# EAGLE design Solenoid Driver x8 (EAGLE 9.6.2)
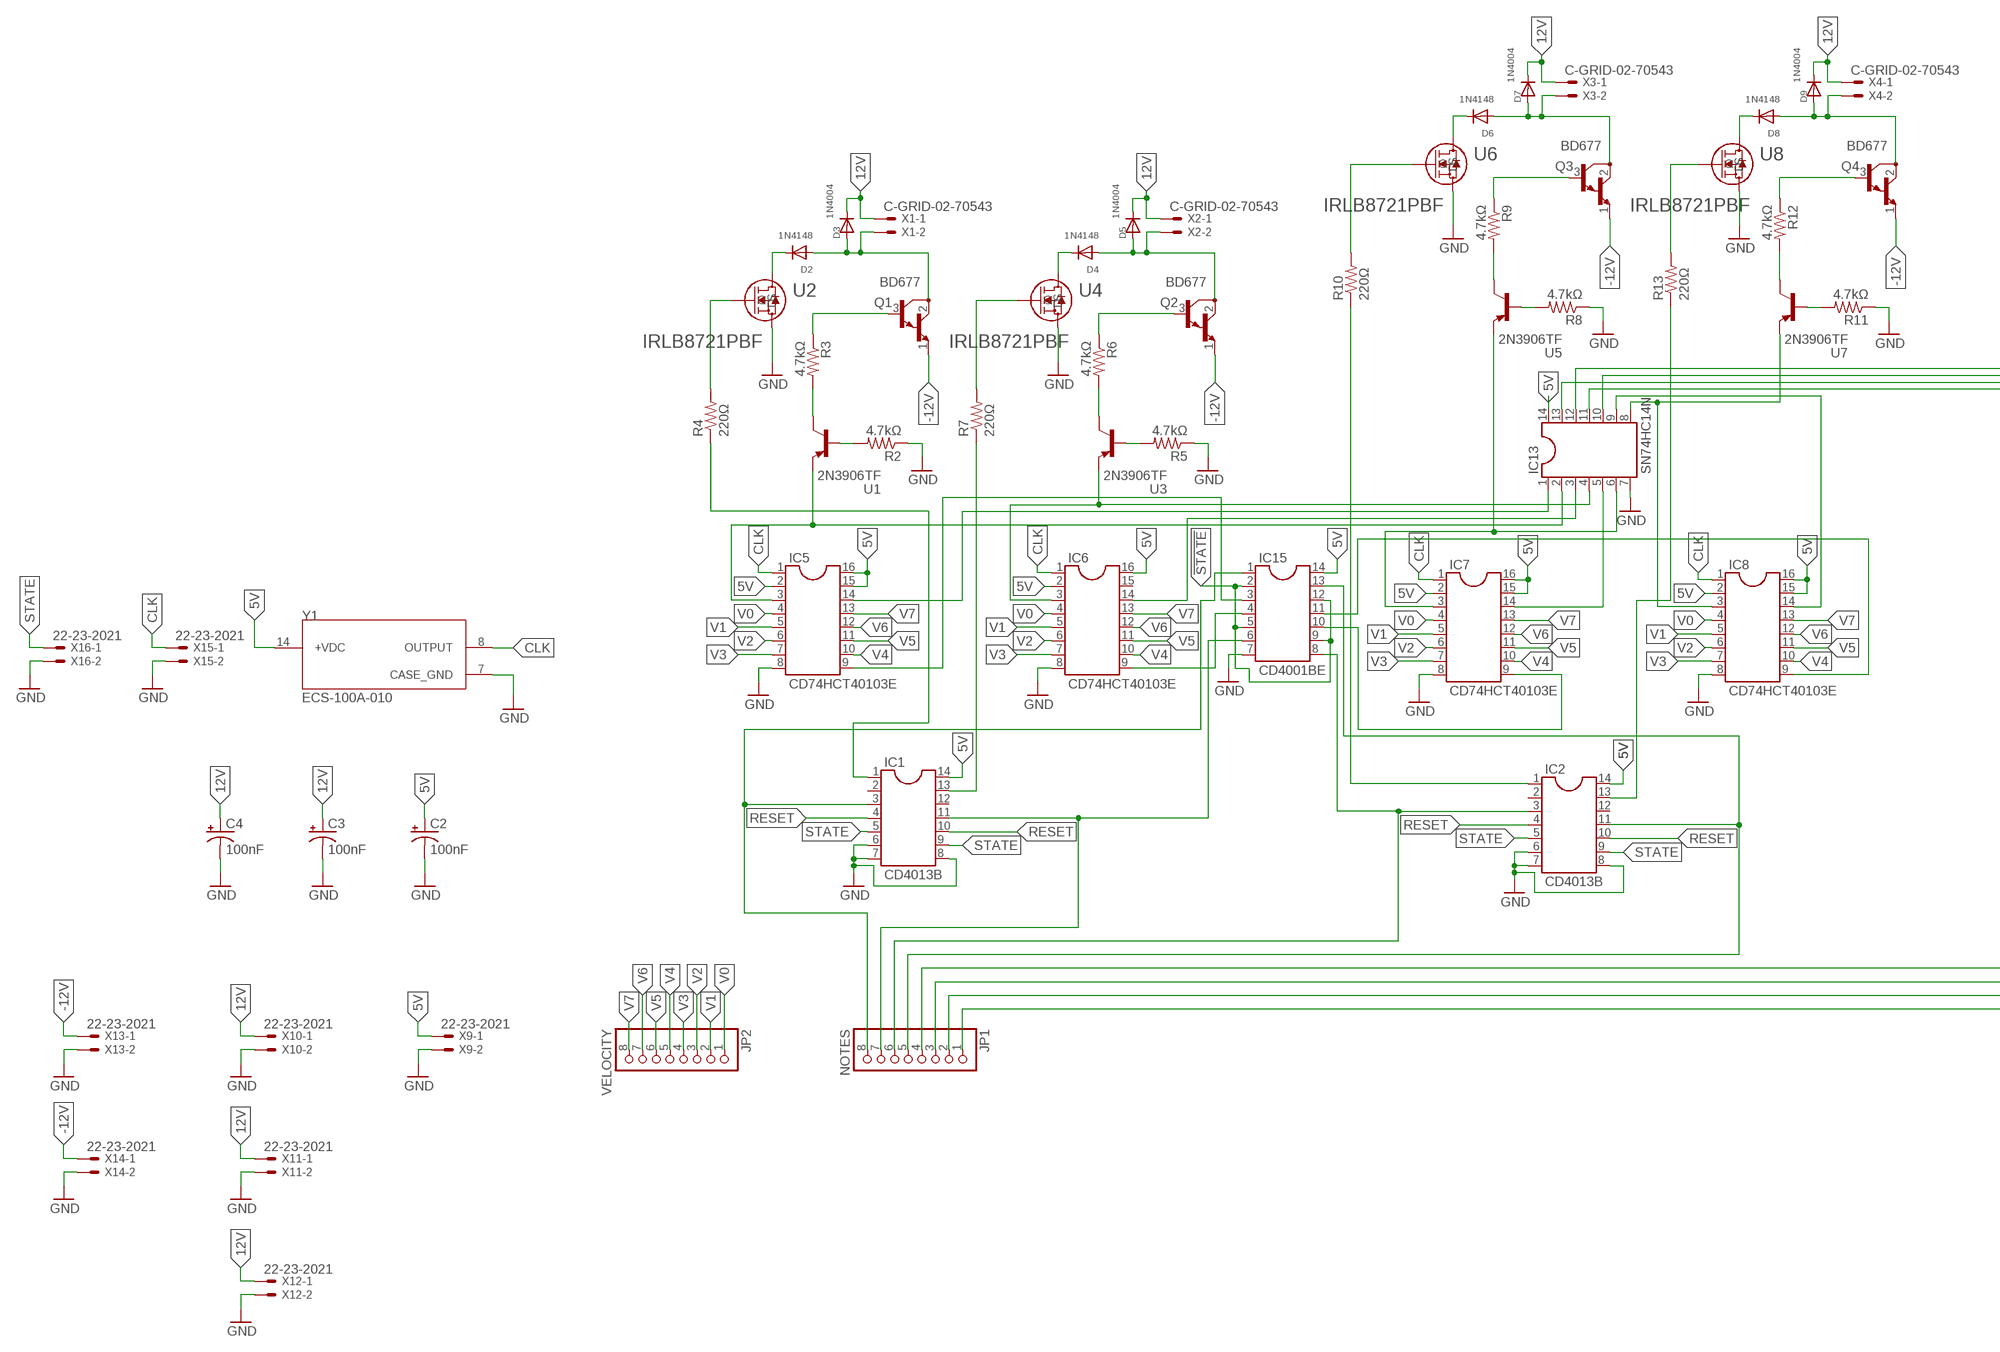
[diagram p0: schematic, sheet 1, part 1 of 2]
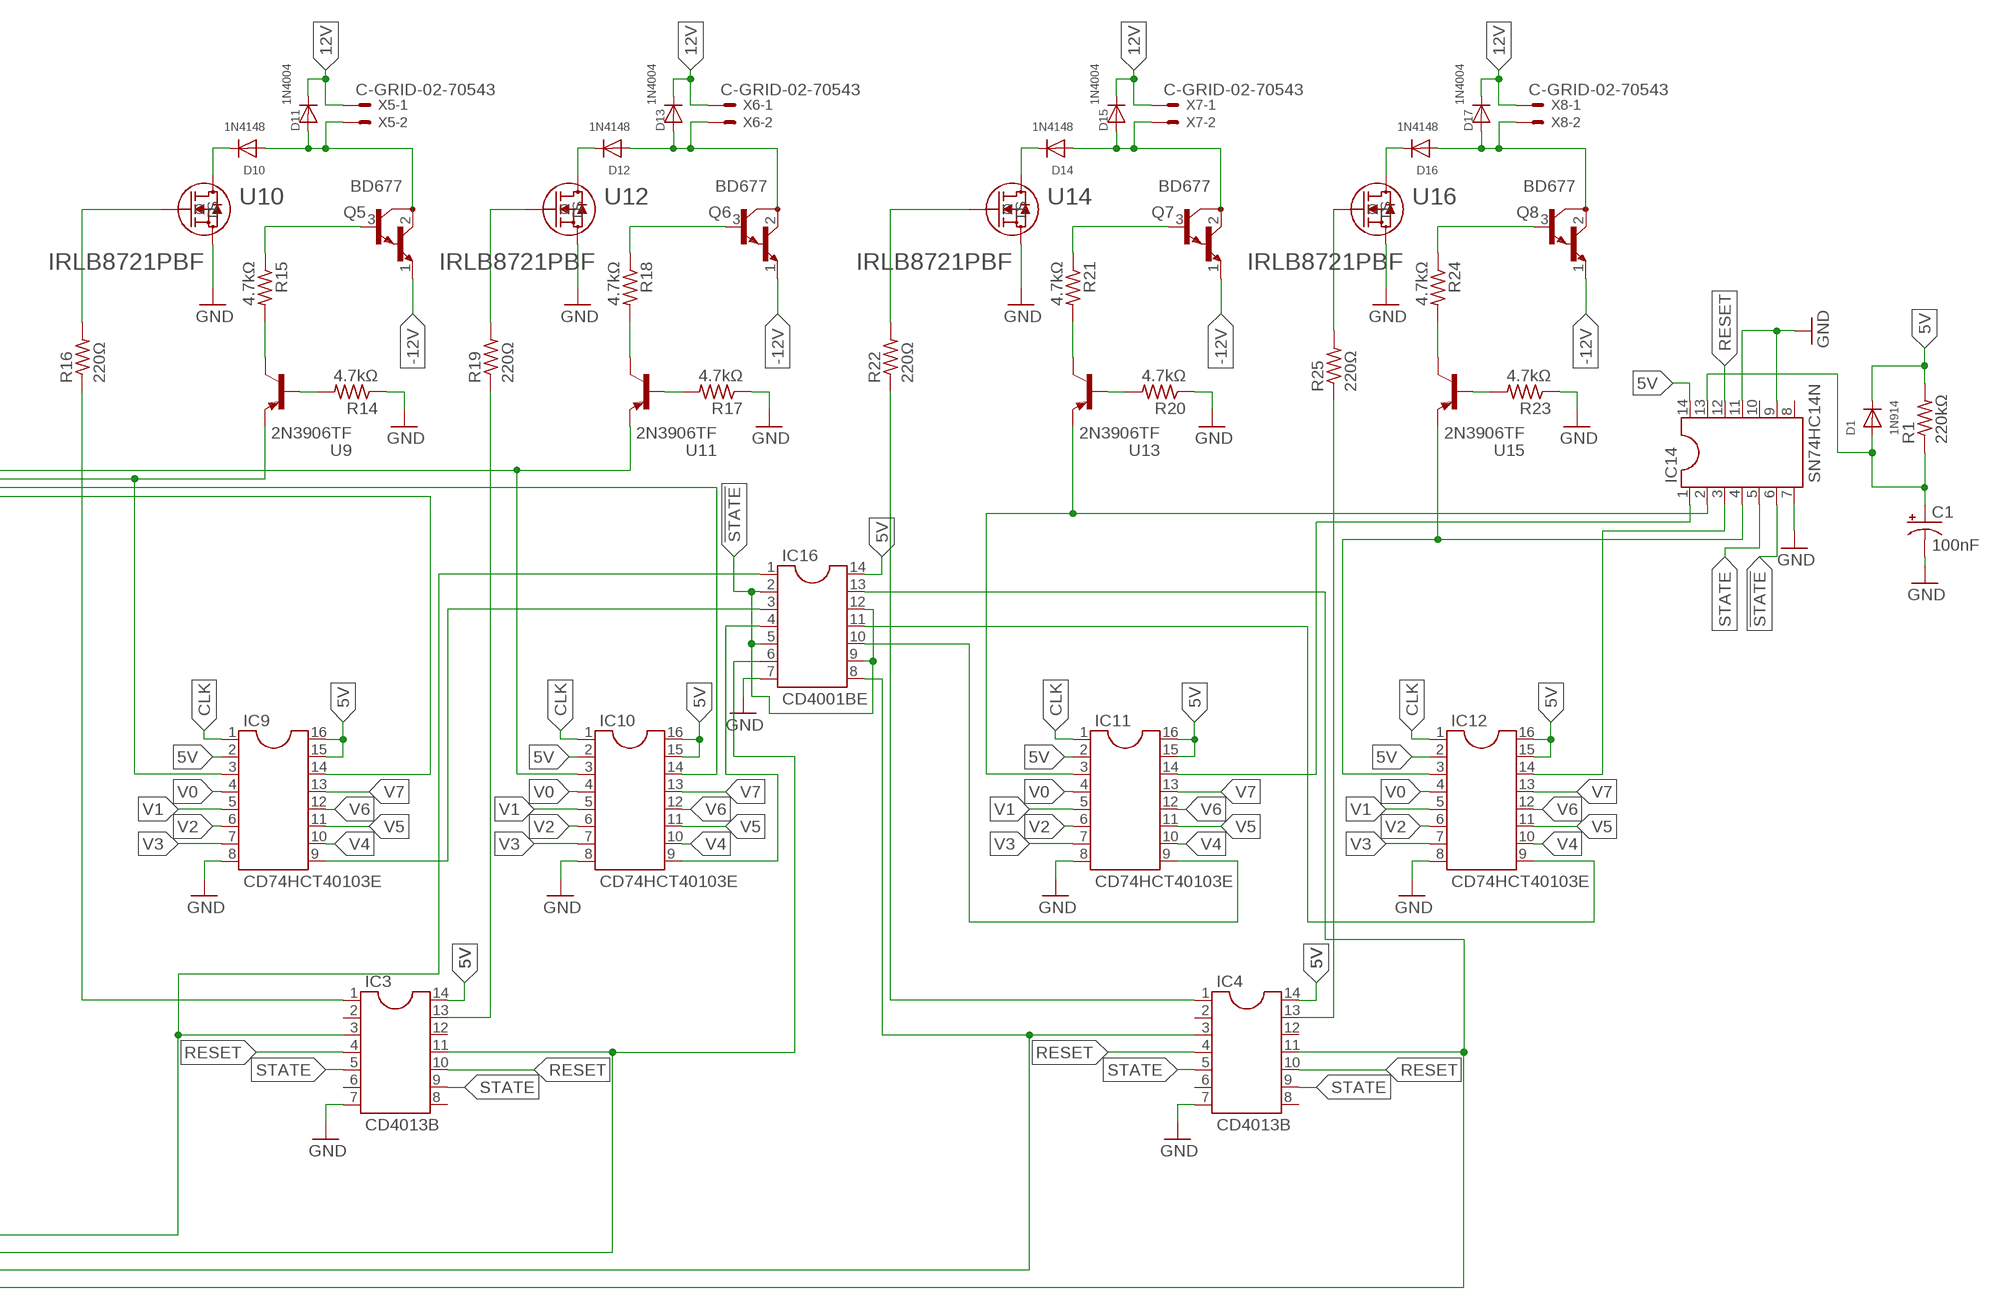
[diagram p1: schematic, sheet 1, part 2 of 2]

## Parts
C1  100nF  CPOL-USE1.8-4  [E1,8-4]
C2  100nF  CPOL-USE1.8-4  [E1,8-4]
C3  100nF  CPOL-USE1.8-4  [E1,8-4]
C4  100nF  CPOL-USE1.8-4  [E1,8-4]
D1  1N914  DIODEDO-1N4148  [DO-1N4148]
D2  1N4148  DIODEDO-1N4148  [DO-1N4148]
D3  1N4004  DIODEDO-1N4148  [DO-1N4148]
D4  1N4148  DIODEDO-1N4148  [DO-1N4148]
D5  1N4004  DIODEDO-1N4148  [DO-1N4148]
D6  1N4148  DIODEDO-1N4148  [DO-1N4148]
D7  1N4004  DIODEDO-1N4148  [DO-1N4148]
D8  1N4148  DIODEDO-1N4148  [DO-1N4148]
D9  1N4004  DIODEDO-1N4148  [DO-1N4148]
D10  1N4148  DIODEDO-1N4148  [DO-1N4148]
D11  1N4004  DIODEDO-1N4148  [DO-1N4148]
D12  1N4148  DIODEDO-1N4148  [DO-1N4148]
D13  1N4004  DIODEDO-1N4148  [DO-1N4148]
D14  1N4148  DIODEDO-1N4148  [DO-1N4148]
D15  1N4004  DIODEDO-1N4148  [DO-1N4148]
D16  1N4148  DIODEDO-1N4148  [DO-1N4148]
D17  1N4004  DIODEDO-1N4148  [DO-1N4148]
IC1  CD4013B  DIL14S  [SOCKET-14]
IC2  CD4013B  DIL14S  [SOCKET-14]
IC3  CD4013B  DIL14S  [SOCKET-14]
IC4  CD4013B  DIL14S  [SOCKET-14]
IC5  CD74HCT40103E  DIL16S  [SOCKET-16]
IC6  CD74HCT40103E  DIL16S  [SOCKET-16]
IC7  CD74HCT40103E  DIL16S  [SOCKET-16]
IC8  CD74HCT40103E  DIL16S  [SOCKET-16]
IC9  CD74HCT40103E  DIL16S  [SOCKET-16]
IC10  CD74HCT40103E  DIL16S  [SOCKET-16]
IC11  CD74HCT40103E  DIL16S  [SOCKET-16]
IC12  CD74HCT40103E  DIL16S  [SOCKET-16]
IC13  SN74HC14N  DIL14S  [SOCKET-14]
IC14  SN74HC14N  DIL14S  [SOCKET-14]
IC15  CD4001BE  DIL14S  [SOCKET-14]
IC16  CD4001BE  DIL14S  [SOCKET-14]
JP1  NOTES  PINHD-1X8BIG  [1X08-BIG]
JP2  VELOCITY  PINHD-1X8BIG  [1X08-BIG]
Q1  BD677  [TO126]
Q2  BD677  [TO126]
Q3  BD677  [TO126]
Q4  BD677  [TO126]
Q5  BD677  [TO126]
Q6  BD677  [TO126]
Q7  BD677  [TO126]
Q8  BD677  [TO126]
R1  220kΩ  R-US_0207/10  [0207/10]
R2  4.7kΩ  R-US_0207/10  [0207/10]
R3  4.7kΩ  R-US_0207/10  [0207/10]
R4  220Ω  R-US_0207/10  [0207/10]
R5  4.7kΩ  R-US_0207/10  [0207/10]
R6  4.7kΩ  R-US_0207/10  [0207/10]
R7  220Ω  R-US_0207/10  [0207/10]
R8  4.7kΩ  R-US_0207/10  [0207/10]
R9  4.7kΩ  R-US_0207/10  [0207/10]
R10  220Ω  R-US_0207/10  [0207/10]
R11  4.7kΩ  R-US_0207/10  [0207/10]
R12  4.7kΩ  R-US_0207/10  [0207/10]
R13  220Ω  R-US_0207/10  [0207/10]
R14  4.7kΩ  R-US_0207/10  [0207/10]
R15  4.7kΩ  R-US_0207/10  [0207/10]
R16  220Ω  R-US_0207/10  [0207/10]
R17  4.7kΩ  R-US_0207/10  [0207/10]
R18  4.7kΩ  R-US_0207/10  [0207/10]
R19  220Ω  R-US_0207/10  [0207/10]
R20  4.7kΩ  R-US_0207/10  [0207/10]
R21  4.7kΩ  R-US_0207/10  [0207/10]
R22  220Ω  R-US_0207/10  [0207/10]
R23  4.7kΩ  R-US_0207/10  [0207/10]
R24  4.7kΩ  R-US_0207/10  [0207/10]
R25  220Ω  R-US_0207/10  [0207/10]
U1  2N3906TF  [TO-92-3L_5P33X5P2_ONS]
U2  IRLB8721PBF  [PG-TO220-3_INF]
U3  2N3906TF  [TO-92-3L_5P33X5P2_ONS]
U4  IRLB8721PBF  [PG-TO220-3_INF]
U5  2N3906TF  [TO-92-3L_5P33X5P2_ONS]
U6  IRLB8721PBF  [PG-TO220-3_INF]
U7  2N3906TF  [TO-92-3L_5P33X5P2_ONS]
U8  IRLB8721PBF  [PG-TO220-3_INF]
U9  2N3906TF  [TO-92-3L_5P33X5P2_ONS]
U10  IRLB8721PBF  [PG-TO220-3_INF]
U11  2N3906TF  [TO-92-3L_5P33X5P2_ONS]
U12  IRLB8721PBF  [PG-TO220-3_INF]
U13  2N3906TF  [TO-92-3L_5P33X5P2_ONS]
U14  IRLB8721PBF  [PG-TO220-3_INF]
U15  2N3906TF  [TO-92-3L_5P33X5P2_ONS]
U16  IRLB8721PBF  [PG-TO220-3_INF]
X1  C-GRID-02-70543  [70543-02]
X2  C-GRID-02-70543  [70543-02]
X3  C-GRID-02-70543  [70543-02]
X4  C-GRID-02-70543  [70543-02]
X5  C-GRID-02-70543  [70543-02]
X6  C-GRID-02-70543  [70543-02]
X7  C-GRID-02-70543  [70543-02]
X8  C-GRID-02-70543  [70543-02]
X9  22-23-2021  [22-23-2021]
X10  22-23-2021  [22-23-2021]
X11  22-23-2021  [22-23-2021]
X12  22-23-2021  [22-23-2021]
X13  22-23-2021  [22-23-2021]
X14  22-23-2021  [22-23-2021]
X15  22-23-2021  [22-23-2021]
X16  22-23-2021  [22-23-2021]
Y1  ECS-100A-010  [OSC_ECS-100A-010]

## Nets
5V: C2.+ D1.C IC1.14 IC2.14 IC3.14 IC4.14 IC5.2 IC5.15 IC5.16 IC6.2 IC6.16 IC7.2 IC7.15 IC7.16 IC8.2 IC8.15 IC8.16 IC9.2 IC9.15 IC9.16 IC10.2 IC10.15 IC10.16 IC11.2 IC11.15 IC11.16 IC12.2 IC12.15 IC12.16 IC13.14 IC14.14 IC15.14 IC16.14 R1.2 X9.1 Y1.14(+VDC)
12V: C3.+ C4.+ D3.C D5.C D7.C D9.C D11.C D13.C D15.C D17.C X1.1 X2.1 X3.1 X4.1 X5.1 X6.1 X7.1 X8.1 X10.1 X11.1 X12.1
!STATE: IC14.6 IC15.2 IC15.5 IC15.9 IC15.12 IC16.2 IC16.5 IC16.9 IC16.12
-12V: Q1.1(E) Q2.1(E) Q3.1(E) Q4.1(E) Q5.1(E) Q6.1(E) Q7.1(E) Q8.1(E) X13.1 X14.1
CLK: IC5.1 IC6.1 IC7.1 IC8.1 IC9.1 IC10.1 IC11.1 IC12.1 X15.1 Y1.8(OUTPUT)
GND: C1.- C2.- C3.- C4.- IC1.6 IC1.7 IC1.8 IC2.6 IC2.7 IC2.8 IC3.7 IC4.7 IC5.8 IC6.8 IC7.8 IC8.8 IC9.8 IC10.8 IC11.8 IC12.8 IC13.7 IC14.7 IC14.9 IC14.11 IC15.7 IC16.7 R2.1 R5.1 R8.1 R11.1 R14.1 R17.1 R20.1 R23.1 U2.3(S) U4.3(S) U6.3(S) U8.3(S) U10.3(S) U12.3(S) U14.3(S) U16.3(S) X9.2 X10.2 X11.2 X12.2 X13.2 X14.2 X15.2 X16.2 Y1.7(CASE_GND)
N$1: IC1.3 IC15.1 JP1.8
N$2: IC5.14 IC13.1
N$3: IC2.3 IC15.8 JP1.6
N$4: IC2.11 IC15.13 JP1.5
N$5: IC9.9 IC16.3
N$6: IC3.11 IC16.6 JP1.3
N$7: IC4.3 IC16.8 JP1.2
N$8: IC4.11 IC16.13 JP1.1
N$9: IC5.9 IC15.3
N$10: IC1.1 R4.1
N$11: IC5.3 IC13.2 U1.1(E)
N$12: Q1.3(B) R3.1
N$13: R3.2 U1.3(C)
N$14: R2.2 U1.2(B)
N$15: IC6.3 IC13.4 U3.1(E)
N$16: D2.A D3.A Q1.2(C) X1.2
N$17: D2.C U2.2(D)
N$18: IC1.11 IC15.6 JP1.7
N$19: C1.+ D1.A IC14.13 R1.1
N$20: R4.2 U2.1(G)
N$21: IC6.9 IC15.4
N$22: IC11.9 IC16.10
N$23: IC6.14 IC13.3
N$24: IC2.13 R13.1
N$25: Q2.3(B) R6.1
N$26: IC12.9 IC16.11
N$27: IC8.14 IC13.9
N$28: IC7.14 IC13.5
N$29: R6.2 U3.3(C)
N$30: IC3.3 IC16.1 JP1.4
N$31: IC3.1 R16.1
N$32: R5.2 U3.2(B)
N$34: D4.A D5.A Q2.2(C) X2.2
N$35: R7.2 U4.1(G)
N$36: D4.C U4.2(D)
N$38: IC4.1 R22.1
N$39: IC1.13 R7.1
N$41: IC12.14 IC14.3
N$42: IC11.14 IC14.1
N$43: Q5.3(B) R15.1
N$44: IC9.14 IC13.11
N$45: IC10.14 IC13.13
N$46: Q3.3(B) R9.1
N$47: R9.2 U5.3(C)
N$48: R8.2 U5.2(B)
N$49: D6.A D7.A Q3.2(C) X3.2
N$50: R10.2 U6.1(G)
N$51: D6.C U6.2(D)
N$52: IC7.3 IC13.6 U5.1(E)
N$53: Q4.3(B) R12.1
N$54: R12.2 U7.3(C)
N$55: R11.2 U7.2(B)
N$56: D8.A D9.A Q4.2(C) X4.2
N$57: R13.2 U8.1(G)
N$58: D8.C U8.2(D)
N$59: IC8.3 IC13.8 U7.1(E)
N$60: R15.2 U9.3(C)
N$61: IC2.1 R10.1
N$62: R14.2 U9.2(B)
N$63: D10.A D11.A Q5.2(C) X5.2
N$64: R16.2 U10.1(G)
N$65: D10.C U10.2(D)
N$67: Q6.3(B) R18.1
N$68: R18.2 U11.3(C)
N$69: R17.2 U11.2(B)
N$70: D12.A D13.A Q6.2(C) X6.2
N$71: R19.2 U12.1(G)
N$72: D12.C U12.2(D)
N$73: IC10.3 IC13.12 U11.1(E)
N$74: IC7.9 IC15.10
N$75: IC3.13 R19.1
N$76: Q7.3(B) R21.1
N$77: R21.2 U13.3(C)
N$78: R20.2 U13.2(B)
N$79: D14.A D15.A Q7.2(C) X7.2
N$80: R22.2 U14.1(G)
N$81: D14.C U14.2(D)
N$82: IC11.3 IC14.2 U13.1(E)
N$83: Q8.3(B) R24.1
N$84: R24.2 U15.3(C)
N$85: R23.2 U15.2(B)
N$86: D16.A D17.A Q8.2(C) X8.2
N$87: R25.2 U16.1(G)
N$88: D16.C U16.2(D)
N$89: IC12.3 IC14.4 U15.1(E)
N$90: IC4.13 R25.1
N$91: IC8.9 IC15.11
N$92: IC10.9 IC16.4
N$93: IC9.3 IC13.10 U9.1(E)
RESET: IC1.4 IC1.10 IC2.4 IC2.10 IC3.4 IC3.10 IC4.4 IC4.10 IC14.12
STATE: IC1.5 IC1.9 IC2.5 IC2.9 IC3.5 IC3.9 IC4.5 IC4.9 IC14.5 X16.1
V0: IC5.4 IC6.4 IC7.4 IC8.4 IC9.4 IC10.4 IC11.4 IC12.4 JP2.1
V1: IC5.5 IC6.5 IC7.5 IC8.5 IC9.5 IC10.5 IC11.5 IC12.5 JP2.2
V2: IC5.6 IC6.6 IC7.6 IC8.6 IC9.6 IC10.6 IC11.6 IC12.6 JP2.3
V3: IC5.7 IC6.7 IC7.7 IC8.7 IC9.7 IC10.7 IC11.7 IC12.7 JP2.4
V4: IC5.10 IC6.10 IC7.10 IC8.10 IC9.10 IC10.10 IC11.10 IC12.10 JP2.5
V5: IC5.11 IC6.11 IC7.11 IC8.11 IC9.11 IC10.11 IC11.11 IC12.11 JP2.6
V6: IC5.12 IC6.12 IC7.12 IC8.12 IC9.12 IC10.12 IC11.12 IC12.12 JP2.7
V7: IC5.13 IC6.13 IC7.13 IC8.13 IC9.13 IC10.13 IC11.13 IC12.13 JP2.8
Unconnected: IC1.2 IC1.12 IC2.2 IC2.12 IC3.2 IC3.6 IC3.8 IC3.12 IC4.2 IC4.6 IC4.8 IC4.12 IC6.15 IC14.8 IC14.10

## Library data of the parts
C1-C4 = adafruit:CPOL-US: POLARIZED CAPACITOR, American symbol
D1-D17 = adafruit:DIODE: Diode SMADIODE - SMA Surface Mount Package 20V 1A Schottky Diode Digikey: 641-1014-6-ND DO-1N4148 - Through Hole Small Current Diode SOD-123 20V 1 A (.5mV Vf) Schottky Diode - Digikey: MBRX120TPMSCT-ND SOD-323 10V 570mA (.38mV Vf, 3ns) Schottky Diode - Digikey: ZLLS410CT-ND SOD-523 30V 30mA Schottky Diode (RB751S-40TE61) - Digikey: RB751S-40TE61CT-ND SOT23-R/W - SOT23 Package (R = Solder Paste/Reflow Ovens, W = Hand-Soldering) BAT54Film 40V 300mA - Digikey: 497-7162-1-ND
IC1-IC4 IC13-IC16 = ic-package:DIL14: Dual In Line / Socket
IC5-IC12 = ic-package-with-sockets:DIL16: Dual In Line / Socket
JP1 JP2 = adafruit:PINHD-1X8: PIN HEADER
Q1-Q8 = transistor-npn:BD677*: NPN Darlington Transistor
R1-R25 = adafruit:R-US_: RESISTOR, American symbol
U1 U3 U5 U7 U9 U11 U13 U15 = components:2N3906TF: PNP Transistor; COPYRIGHT: Copyright (C) 2024 Ultra Librarian. All rights reserved.; MANUFACTURER_PART_NUMBER: 2N3906TF; MFR_NAME: onsemi
U2 U4 U6 U8 U10 U12 U14 U16 = components:IRLB8721PBF; COPYRIGHT: Copyright (C) 2024 Ultra Librarian. All rights reserved.; MANUFACTURER_PART_NUMBER: IRLB8721PBF; MFR_NAME: Infineon
X1-X8 = con-molex:C-GRID-02: CONNECTOR wire to board 2.54 mm (0.100") pitch header; MF: MOLEX; OC_FARNELL: unknown; OC_NEWARK: unknown
X9-X16 = con-molex:22-23-2021: .100" (2.54mm) Center Header - 2 Pin; MF: MOLEX; MPN: 22-23-2021; OC_FARNELL: 1462926; OC_NEWARK: 25C3832
Y1 = ECS-100A-010:ECS-100A-010: Oscillator 14-DIP, 4 Leads (Full Size, Metal Can); MANUFACTURER: ECS Inc.; STANDARD: MANUFACTURER RECOMMENDATIONS

## Board
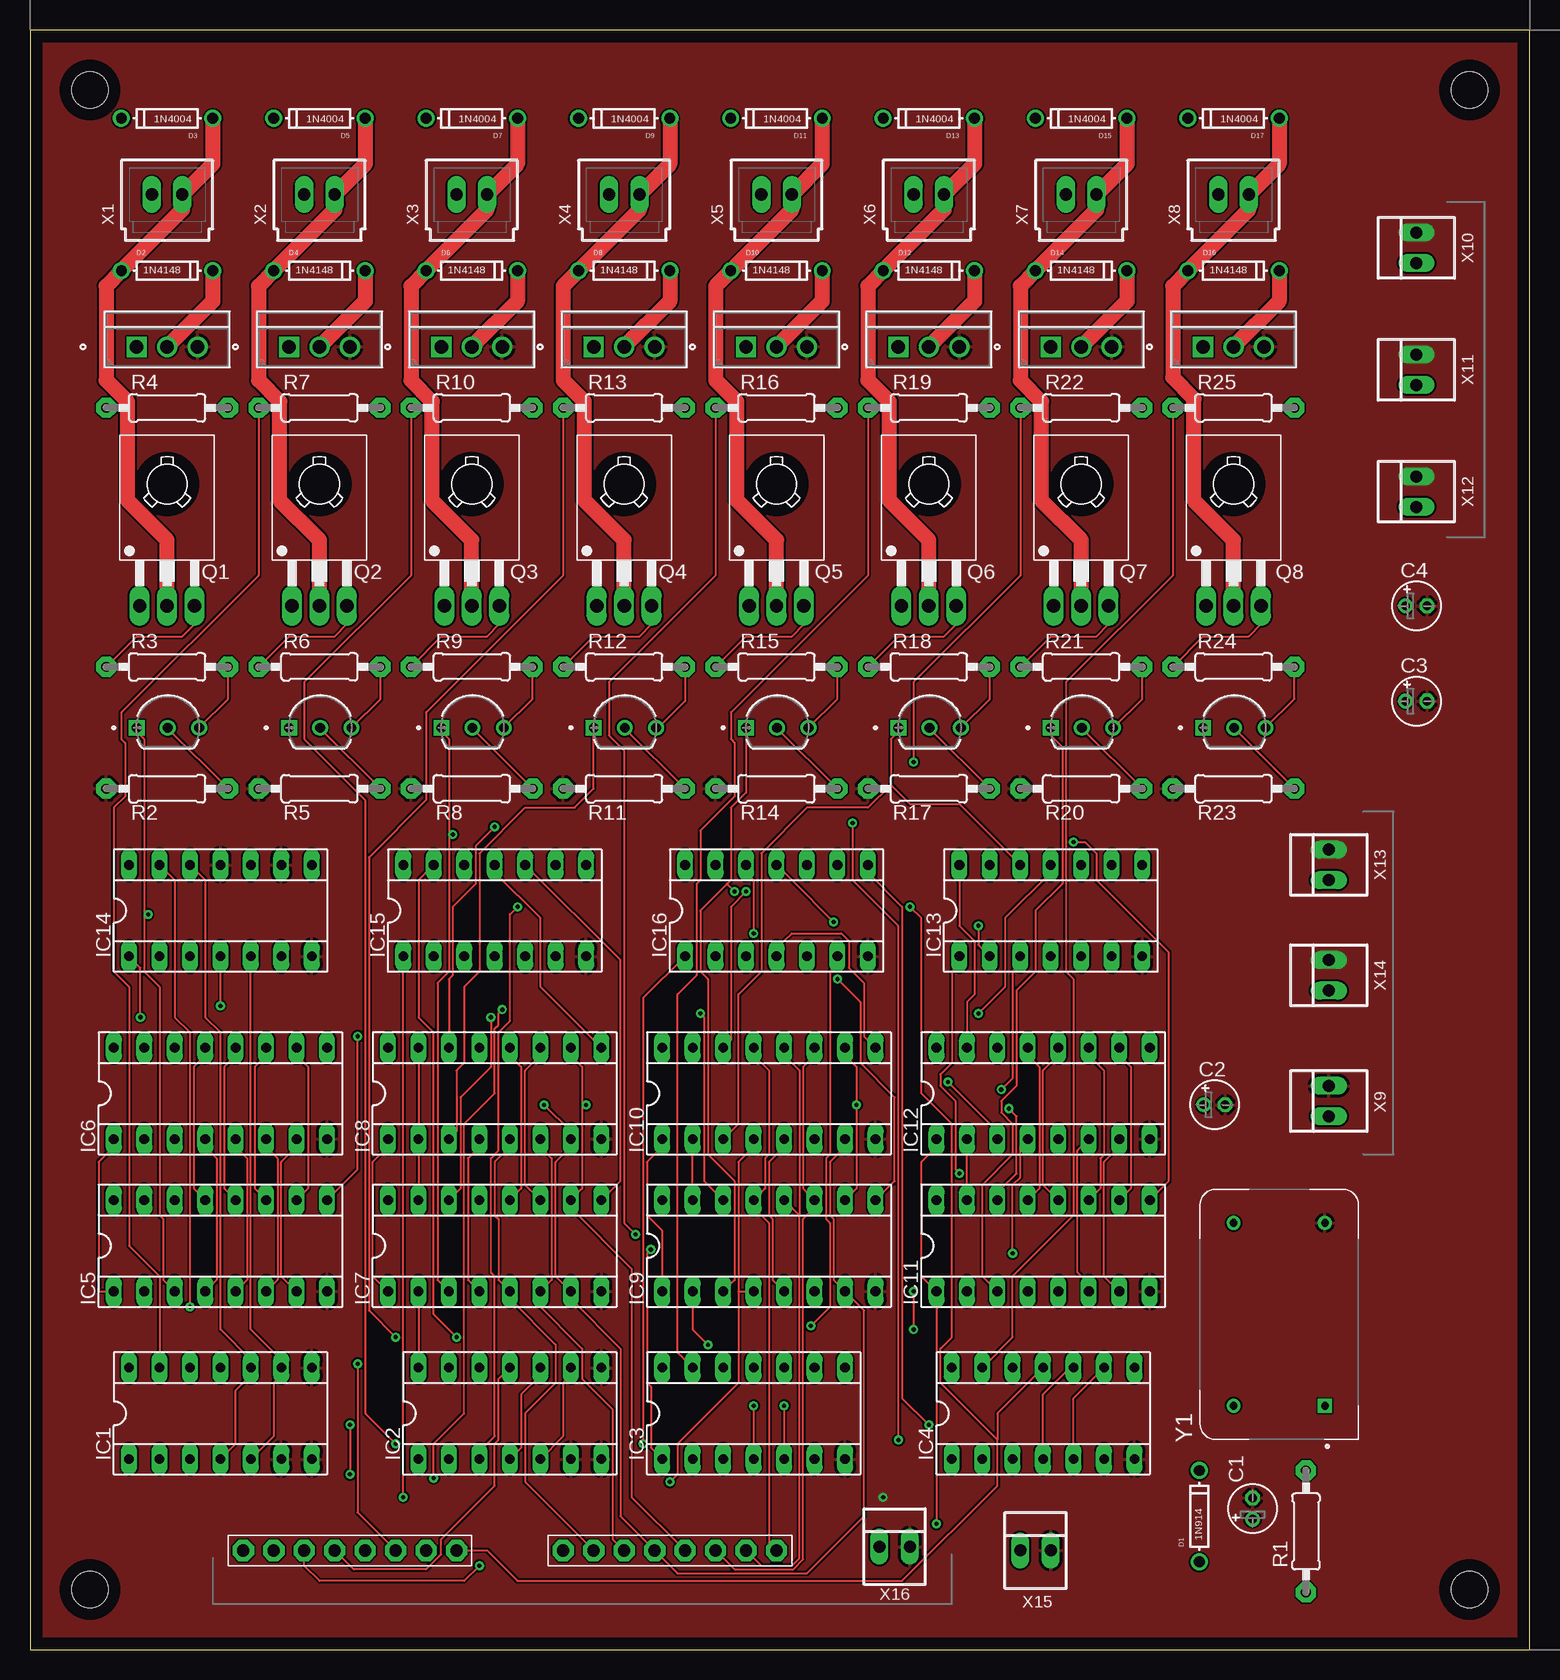
[diagram p2: board, top side]
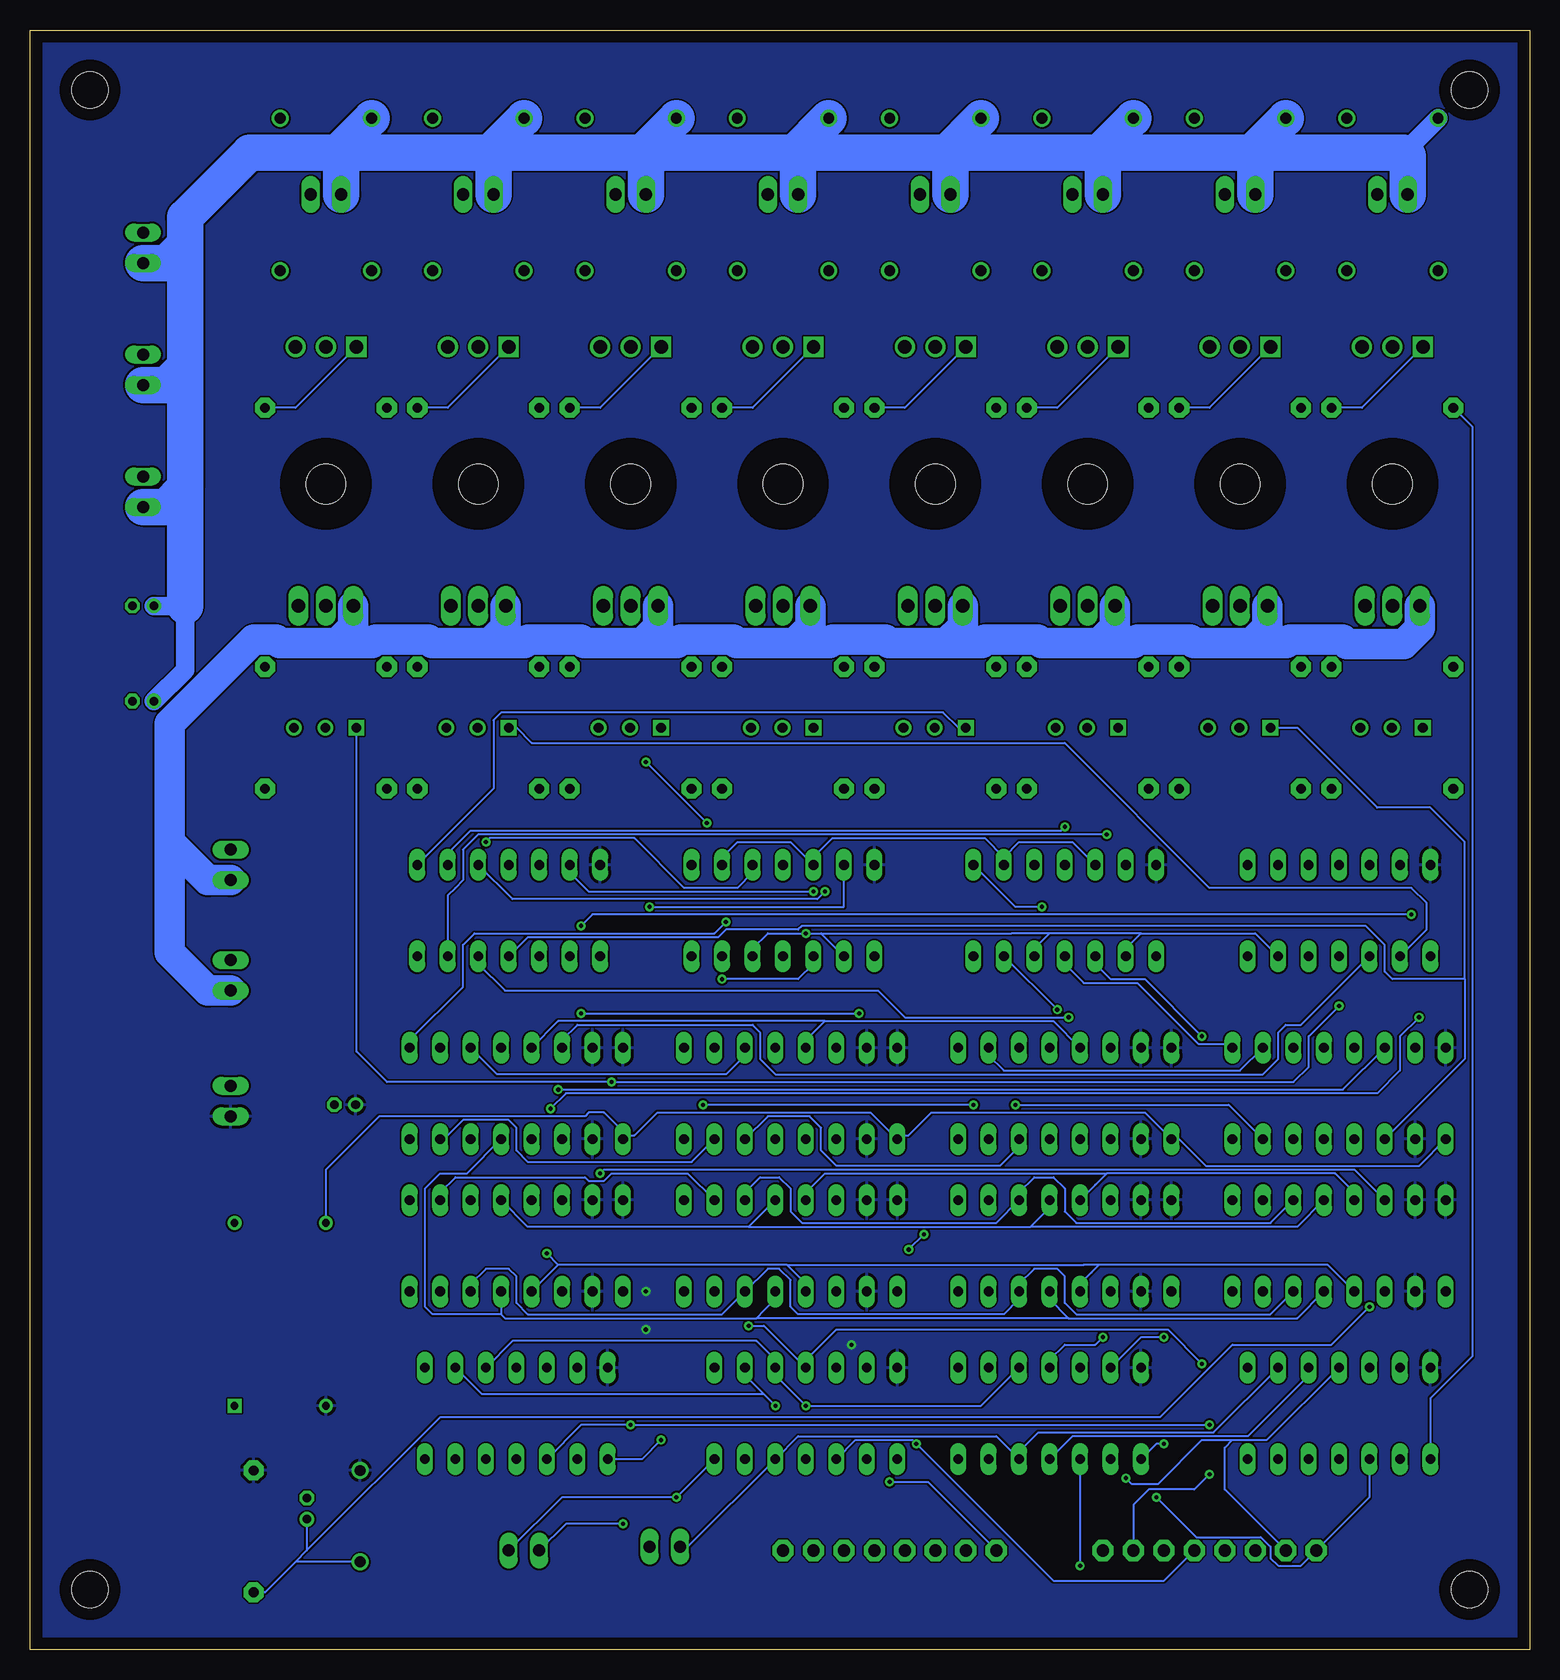
[diagram p3: board, bottom side, seen from below]

Size 125 x 135 mm. Coordinates in mm from the lower left corner, seen from the top.
Outline: 0,0 125,0 125,135 0,135 0,0
Copper layers (1*16): Top 0.035mm / dielectric 1.5mm / Bottom 0.035mm
Design rules "default": minimum track width 6mil, minimum drill 0.35mm, track to track 6mil, track to pad 6mil, pad to pad 6mil, via to via 6mil, smd to smd 6mil, copper to edge 40mil, drill to drill 6mil, minimum pad ring 10mil, minimum via ring 8mil, stop-mask expansion 4mil, vias tented up to drill 0mil, thermal gap 10mil
Holes 3 mm at 5,130 120,130 5,5 120,5

### Footprints (pad centres in the part's own frame; a part is rotated, then mirrored left to right if it is on the bottom)
E1,8-4 = drill 0.711 pad 1.168: + -0.889,0 | drill 0.711 pad 1.168 octagon: - 0.889,0
DO-1N4148 = drill 0.9: A -3.81,0; C 3.81,0
SOCKET-14 = drill 0.813 long: 1 -7.62,-3.81; 2 -5.08,-3.81; 3 -2.54,-3.81; 4 0,-3.81; 5 2.54,-3.81; 6 5.08,-3.81; 7 7.62,-3.81; 8 7.62,3.81; 9 5.08,3.81; 10 2.54,3.81; 11 0,3.81; 12 -2.54,3.81; 13 -5.08,3.81; 14 -7.62,3.81
SOCKET-16 = drill 0.813 long: 1 -8.89,-3.81; 2 -6.35,-3.81; 3 -3.81,-3.81; 4 -1.27,-3.81; 5 1.27,-3.81; 6 3.81,-3.81; 7 6.35,-3.81; 8 8.89,-3.81; 9 8.89,3.81; 10 6.35,3.81; 11 3.81,3.81; 12 1.27,3.81; 13 -1.27,3.81; 14 -3.81,3.81; 15 -6.35,3.81; 16 -8.89,3.81
1X08-BIG = drill 1.016 pad 1.778 octagon: 1 -8.89,0; 2 -6.35,0; 3 -3.81,0; 4 -1.27,0; 5 1.27,0; 6 3.81,0; 7 6.35,0; 8 8.89,0
TO126 = drill 1.118 long: 1 -2.286,-5.08; 2 0,-5.08; 3 2.286,-5.08 | hole 3.302: 0,5.08
0207/10 = drill 0.813 pad 1.676 octagon: 1 -5.08,0; 2 5.08,0
TO-92-3L_5P33X5P2_ONS = drill 0.813 pad 1.321 square: 1 0,0 | drill 0.813 pad 1.321: 2 2.591,0; 3 5.207,0
PG-TO220-3_INF = drill 1.118 pad 1.626 square: 1 0,0 | drill 1.118 pad 1.626: 2 2.54,0; 3 5.08,0
70543-02 = drill 1.016 long: 1 -1.27,0; 2 1.27,0
22-23-2021 = drill 1 long: 1 -1.27,0; 2 1.27,0
OSC_ECS-100A-010 = drill 0.65 square: 1 -7.62,-3.81 | drill 0.65: 7 7.62,-3.81; 8 7.62,3.81; 14 -7.62,3.81

### Placement (x,y rotation side)
C1  101.92,11.75 90 top
C2  98.74,45.4 0 top
C3  115.57,79.06 0 top
C4  115.57,87 0 top
D1  97.47,11.11 90 top
D2  11.43,114.94 0 top
D3  11.43,127.64 180 top
D4  24.13,114.94 0 top
D5  24.13,127.64 180 top
D6  36.83,114.94 0 top
D7  36.83,127.64 180 top
D8  49.53,114.94 0 top
D9  49.53,127.64 180 top
D10  62.23,114.94 0 top
D11  62.23,127.64 180 top
D12  74.93,114.94 0 top
D13  74.93,127.64 180 top
D14  87.63,114.94 0 top
D15  87.63,127.64 180 top
D16  100.33,114.94 0 top
D17  100.33,127.64 180 top
IC1  15.88,19.68 0 top
IC2  40.01,19.68 0 top
IC3  60.33,19.68 0 top
IC4  84.45,19.68 0 top
IC5  15.88,33.66 0 top
IC6  15.88,46.35 0 top
IC7  38.73,33.66 0 top
IC8  38.73,46.35 0 top
IC9  61.59,33.66 0 top
IC10  61.59,46.35 0 top
IC11  84.45,33.66 0 top
IC12  84.45,46.35 0 top
IC13  85.09,61.59 0 top
IC14  15.88,61.59 0 top
IC15  38.73,61.59 0 top
IC16  62.23,61.59 0 top
JP1  26.67,8.26 180 top
JP2  53.34,8.26 0 top
Q1  11.43,92.08 0 top
Q2  24.13,92.08 0 top
Q3  36.83,92.08 0 top
Q4  49.53,92.08 0 top
Q5  62.23,92.08 0 top
Q6  74.93,92.08 0 top
Q7  87.63,92.08 0 top
Q8  100.33,92.08 0 top
R1  106.36,9.84 90 top
R2  11.43,71.75 0 top
R3  11.43,81.92 0 top
R4  11.43,103.5 0 top
R5  24.13,71.75 0 top
R6  24.13,81.92 0 top
R7  24.13,103.5 0 top
R8  36.83,71.75 0 top
R9  36.83,81.92 0 top
R10  36.83,103.5 0 top
R11  49.53,71.75 0 top
R12  49.53,81.92 0 top
R13  49.53,103.5 0 top
R14  62.23,71.75 0 top
R15  62.23,81.92 0 top
R16  62.23,103.5 0 top
R17  74.93,71.75 0 top
R18  74.93,81.92 0 top
R19  74.93,103.5 0 top
R20  87.63,71.75 0 top
R21  87.63,81.92 0 top
R22  87.63,103.5 0 top
R23  100.33,71.75 0 top
R24  100.33,81.92 0 top
R25  100.33,103.5 0 top
U1  8.89,76.83 0 top
U2  8.89,108.58 0 top
U3  21.59,76.83 0 top
U4  21.59,108.58 0 top
U5  34.29,76.83 0 top
U6  34.29,108.58 0 top
U7  46.99,76.83 0 top
U8  46.99,108.58 0 top
U9  59.69,76.83 0 top
U10  59.69,108.58 0 top
U11  72.39,76.83 0 top
U12  72.39,108.58 0 top
U13  85.09,76.83 0 top
U14  85.09,108.58 0 top
U15  97.79,76.83 0 top
U16  97.79,108.58 0 top
X1  11.43,121.28 0 top
X2  24.13,121.28 0 top
X3  36.83,121.28 0 top
X4  49.53,121.28 0 top
X5  62.23,121.28 0 top
X6  74.93,121.28 0 top
X7  87.63,121.28 0 top
X8  100.33,121.28 0 top
X9  108.27,45.72 90 top
X10  115.57,116.84 90 top
X11  115.57,106.68 90 top
X12  115.57,96.52 90 top
X13  108.27,65.41 90 top
X14  108.27,56.2 90 top
X15  83.82,8.26 0 top
X16  72.07,8.57 0 top
Y1  104.14,27.94 90 top

### Tracks (layer width: path | path; a pad name or v marks a point on that pad's centre or on a via)
5V  (via drill 0.35)
  Top 0.152: v73.66,29.84 v73.66,26.67 | IC9.2 55.24,26.67 v56.52,25.4 | IC8.15 IC8.2 IC7.15 | IC13.14 77.47,60.33 78.74,59.05 78.74,54.61 78.11,53.98 IC12.15 | IC7.2 IC2.14 | IC9.15 IC10.2 | IC11.15 IC12.2
  pour Bottom: -5,140 -5,-10 130,-10 130,140
12V
  Bottom 1.524: C4.+ 112.08,87 112.08,81.66 C3.+ | D3.C 10.16,125.09
  Bottom 2.032: 10.16,125.09 10.16,124.46
  Bottom 3.048: X1.1 10.16,124.46 10.48,124.78 23.18,124.78 | 23.18,124.78 35.24,124.78 | 35.24,124.78 35.88,124.78 | 35.88,124.78 47.94,124.78 | 47.94,124.78 48.58,124.78 | 48.58,124.78 60.64,124.78 | 60.64,124.78 61.28,124.78 | 61.28,124.78 73.66,124.78 | 73.66,124.78 73.98,124.78 | 73.98,124.78 86.36,124.78 | 86.36,124.78 86.68,124.78 | 86.68,124.78 98.74,124.78 | 98.74,124.78 99.38,124.78 | 99.38,124.78 106.68,124.78 112.08,119.38 112.08,117.16 | D5.C 23.18,124.78 | X2.1 22.86,124.46 23.18,124.78 | X3.1 35.56,124.46 35.24,124.78 | X4.1 48.26,124.46 47.94,124.78 | X5.1 60.96,124.46 60.64,124.78 | X6.1 73.66,124.78 | X7.1 86.36,124.78 | X8.1 99.06,124.46 98.74,124.78 | D7.C 35.88,124.78 | D9.C 48.58,124.78 | D11.C 61.28,124.78 | D13.C 73.98,124.78 | D15.C 86.68,124.78 | D17.C 99.38,124.78 | 112.08,117.16 112.08,107 | X11.1 113.67,105.41 112.08,107 | 112.08,107 112.08,96.84 | X12.1 113.67,95.25 112.08,96.84 | 112.08,87 112.08,96.84 | X10.1 113.67,115.57 112.08,117.16
!STATE  (via drill 0.35)
  Top 0.152: v60.33,59.69 60.33,64.14 59.69,64.77 IC16.12
  Bottom 0.152: IC14.6 22.86,59.69 32.38,59.69 | 32.38,59.69 33.66,58.42 IC15.2 | 32.38,59.69 39.37,59.69 40.01,59.69 | IC15.12 38.1,67.31 42.55,67.31 43.81,66.04 | 59.05,59.69 IC16.2 | 59.05,59.69 v60.33,59.69 63.5,59.69 64.77,58.42 IC16.5 | 60.01,65.72 61.59,67.31 66.04,67.31 67.31,66.04 IC16.9 | 43.81,66.04 45.4,67.63 58.1,67.63 60.01,65.72 | 43.81,66.04 IC15.9 | 60.01,65.72 IC16.12 | 59.05,59.69 43.18,59.69 40.01,59.69 | 40.01,59.69 41.27,58.42 IC15.5
-12V
  Bottom 2.54: Q1.1 9.14,85.15 10.48,83.82 15.22,83.82 15.57,84.18 19.99,84.18 20.27,83.9 23.19,83.9 | 23.19,83.9 27.99,83.9 28.27,84.18 32.69,84.18 32.97,83.9 35.89,83.9 | 35.89,83.9 40.69,83.9 40.97,84.18 45.39,84.18 45.67,83.9 48.59,83.9 | 48.59,83.9 53.39,83.9 53.67,84.18 58.09,84.18 58.37,83.9 61.28,83.9 | 61.28,83.9 66.09,83.9 66.37,84.18 70.79,84.18 71.07,83.9 73.98,83.9 | 73.98,83.9 78.79,83.9 79.07,84.18 83.49,84.18 83.77,83.9 86.69,83.9 | 86.69,83.9 91.49,83.9 91.77,84.18 96.19,84.18 96.47,83.9 99.39,83.9 | 99.39,83.9 104.19,83.9 104.47,84.18 106.35,84.18 113.35,77.17 113.35,67.31 | Q2.1 21.84,85.25 23.19,83.9 | Q3.1 34.54,85.25 35.89,83.9 | Q4.1 47.24,85.25 48.59,83.9 | Q5.1 59.94,85.23 61.28,83.9 | Q8.1 98.04,85.25 99.39,83.9 | Q7.1 85.34,85.25 86.69,83.9 | Q6.1 72.64,85.23 73.98,83.9 | X14.1 110.17,54.93 113.35,58.1 113.35,67.31 | X13.1 110.17,64.14 113.35,67.31
CLK  (via drill 0.35)
  Top 0.152: IC5.1 5.71,29.84 5.71,40.64 6.99,41.91 IC6.1 | IC8.1 29.84,41.91 28.57,40.64 28.57,31.11 IC7.1 | IC9.1 52.7,34.92 51.44,36.2 51.44,40.64 52.7,41.91 IC10.1 | IC12.1 75.56,41.91 74.3,40.64 74.3,31.11 IC11.1 v75.56,10.48
  Bottom 0.152: IC6.1 9.21,40.32 26.99,40.32 29.21,42.55 IC8.1 32.07,44.77 49.85,44.77 51.75,42.86 53.02,42.86 | 75.56,42.86 75.56,43.18 77.15,44.77 78.42,44.77 78.74,44.45 95.89,44.45 100.33,40.01 Y1.8 | 53.02,42.86 54.93,44.77 72.71,44.77 74.61,42.86 75.56,42.86 | 75.56,42.86 IC12.1 | 53.02,42.86 IC10.1 | v75.56,10.48 80.33,10.48 X15.1
GND  (via drill 0.35)
  Bottom 0.152: IC3.7 v71.12,12.7 80.64,12.7 X15.2
  pour Top: -5,140 -5,-15 130,-15 130,140
  pour Top (no thermals): 111.44,120.02 111.44,93.03 120.02,93.03 120.02,120.02
  pour Top (no thermals): 104.46,68.58 104.46,53.02 112.39,53.02 112.39,68.58
N$1  (via drill 0.35)
  Top 0.152: v31.11,12.7 IC15.1
  Bottom 0.152: IC1.3 13.34,12.7 JP1.8 19.05,6.99 20.95,6.99 21.59,7.62 21.59,8.57 22.4,9.37 27.79,9.37 v31.11,12.7
N$2  (via drill 0.35)
  Top 0.152: v77.47,39.69 77.15,40.01 77.15,45.72 75.88,46.99 75.88,47.94 76.83,48.9 76.83,56.52 77.47,57.15 IC13.1
  Bottom 0.152: IC5.14 14.61,40.01 77.15,40.01 v77.47,39.69
N$3  (via drill 0.35)
  Top 0.152: v40.64,61.91 40.01,61.28 40.01,52.39 39.05,51.44 39.05,41.59 38.42,40.96 38.42,31.43 38.73,31.11 38.73,17.78 37.47,16.51 IC2.3 | v37.47,6.99 36.2,5.71 24.13,5.71 22.86,6.99 JP1.6
  Bottom 0.152: IC15.8 42.86,61.91 v40.64,61.91 | IC2.3 v37.47,6.99
N$4  (via drill 0.35)
  Top 0.152: IC2.11 39.05,22.54 39.05,17.46 38.73,17.14 38.73,13.65 34.29,9.21 34.29,7.94 33.02,6.67 26.99,6.67 JP1.5 | v35.56,26.04 33.66,27.94 33.66,51.44 32.38,52.7 32.38,64.14 IC15.13
  Bottom 0.152: v35.56,26.04 36.2,25.4 38.73,25.4 40.01,24.13 IC2.11
N$5  (via drill 0.35)
  Top 0.152: v67.31,55.88 69.22,53.98 69.22,48.9 72.07,46.04 72.07,39.05 IC9.9
  Bottom 0.152: v67.31,55.88 60.96,55.88 59.69,57.15 IC16.3
N$6  (via drill 0.35)
  Top 0.152: v65.09,26.99 66.67,28.57 66.67,35.56 66.36,35.88 66.36,40.96 66.67,41.27 66.67,56.52 67.31,57.15 IC16.6 | JP1.3 27.3,11.43 v27.3,23.81
  Bottom 0.152: 60.64,23.81 63.82,26.99 v65.09,26.99 | v27.3,23.81 30.16,26.67 57.78,26.67 60.64,23.81 | 60.64,23.81 IC3.11
N$7  (via drill 0.35)
  Top 0.152: v74.93,18.73 72.71,20.95 72.71,61.91 69.85,64.77 IC16.8 | v26.67,18.73 v26.67,14.61
  Bottom 0.152: IC4.3 79.06,18.73 v74.93,18.73 v26.67,18.73 | v26.67,14.61 27.94,13.34 31.75,13.34 33.02,12.06 JP1.2
N$8  (via drill 0.35)
  Top 0.152: 80.64,17.46 80.64,13.65 72.71,5.71 40.64,5.71 38.1,8.26 JP1.1 | 80.64,17.46 80.64,19.68 IC4.11 | v73.34,61.91 74.3,60.96 74.3,46.35 76.83,43.81 76.83,26.04 75.88,25.08 75.88,22.23 80.64,17.46
  Bottom 0.152: IC16.13 57.15,61.91 v73.34,61.91
N$9  (via drill 0.35)
  Top 0.152: v27.3,51.12 27.3,40.01 IC5.9
  Bottom 0.152: v27.3,51.12 32.07,55.88 34.92,55.88 36.2,57.15 IC15.3
N$10
  Bottom 0.152: IC1.1 8.26,20.95 7.94,21.27 4.76,24.45 4.76,101.92 R4.1
N$11  (via drill 0.35)
  Top 0.152: IC5.3 11.11,30.8 11.11,35.88 10.79,36.2 10.79,55.24 9.53,56.52 9.53,61.28 | 9.53,61.28 9.53,75.88 8.89,76.52 U1.1 | IC13.2 79.06,58.74 v79.06,60.33 | 9.53,61.28 v9.84,61.28
  Bottom 0.152: v79.06,60.33 78.11,61.28 v9.84,61.28
N$12
  Top 0.152: R3.1 8.89,84.45 12.7,84.45 13.72,85.47 Q1.3
N$13
  Top 0.152: U1.3 16.51,79.25 R3.2
N$14
  Top 0.152: R2.2 11.48,76.78 U1.2
N$15
  Bottom 0.152: IC6.3 5.4,49.21 5.4,55.88 | 5.4,55.88 5.4,67.31 8.26,70.17 12.7,70.17 19.37,76.83 U3.1 | IC13.4 83.5,59.37 67.63,59.37 66.99,60.01 60.96,60.01 60.64,60.33 13.65,60.33 12.06,58.74 12.06,56.52 11.43,55.88 5.4,55.88
N$16
  Top 1.27: D3.A 15.24,123.83 X1.2 12.7,120.02 D2.A 6.35,113.67 6.35,105.8 8.13,104.03 8.13,95.79 11.43,92.48 Q1.2
N$17
  Top 1.27: D2.C 15.24,112.39 U2.2
N$18  (via drill 0.35)
  Top 0.152: v39.37,53.34 39.05,53.02 39.05,52.07 38.73,51.75 38.73,46.35 36.2,43.81 36.2,19.68 33.66,17.14 v33.66,14.29
  Bottom 0.152: IC1.11 21.91,17.46 24.77,17.46 | 24.77,17.46 27.3,17.46 30.96,13.81 33.18,13.81 v33.66,14.29 | v39.37,53.34 IC15.6 | JP1.7 25.4,13.34 25.4,16.83 24.77,17.46
N$19  (via drill 0.35)
  Top 0.152: v13.34,28.57 13.34,51.44 12.06,52.7 12.06,64.14 IC14.13
  Bottom 0.152: v13.34,28.57 16.51,25.4 24.77,25.4 30.8,19.37 90.81,19.37 101.92,8.26 | 101.92,8.26 102.87,7.3 | 102.87,7.3 105.41,4.76 R1.1 | C1.+ 101.92,8.26 | D1.A 102.87,7.3
N$20
  Bottom 0.152: U2.1 13.97,103.5 R4.2
N$21
  Bottom 0.152: IC6.9 25.08,50.48 27.62,50.48 32.7,55.56 37.15,55.56 38.73,57.15 IC15.4
N$22  (via drill 0.35)
  Top 0.152: v87,67.31 87.95,67.31 88.9,66.36 88.9,64.14 94.93,58.1 94.93,39.05 IC11.9
  Bottom 0.152: v87,67.31 86.68,67.63 74.61,67.63 70.48,63.5 66.04,63.5 64.77,64.77 IC16.10
N$23  (via drill 0.35)
  Top 0.152: v80.96,46.67 81.92,47.62 81.92,56.52 82.55,57.15 IC13.3
  Bottom 0.152: IC6.14 15.56,46.67 v80.96,46.67
N$24  (via drill 0.35)
  Top 0.152: v30.48,26.04 28.26,28.26 28.26,66.04 33.02,70.8 33.02,78.11 44.45,89.53 R13.1
  Bottom 0.152: IC2.13 32.38,26.04 v30.48,26.04
N$25
  Top 0.152: R6.1 21.59,84.45 25.4,84.45 26.42,85.47 Q2.3
N$26  (via drill 0.35)
  Top 0.152: v66.99,60.64 63.5,64.14 IC16.11
  Bottom 0.152: v66.99,60.64 67.94,59.69 87.95,59.69 88.9,58.74 88.9,55.24 93.34,50.8 IC12.9
N$27  (via drill 0.35)
  Top 0.152: IC8.14 34.92,55.88 35.24,56.2 35.24,61.91 37.15,63.82 37.15,66.99 v38.73,68.58
  Bottom 0.152: v38.73,68.58 39.05,68.26 88.27,68.26 90.17,66.36 IC13.9
N$28  (via drill 0.35)
  Top 0.152: IC7.14 35.88,38.42 35.88,46.04 38.42,48.58 v38.42,52.7
  Bottom 0.152: v38.42,52.7 52.07,52.7 54.29,54.93 85.41,54.93 87.63,57.15 IC13.5
N$29
  Top 0.152: U3.3 29.21,79.25 R6.2
N$30  (via drill 0.35)
  Top 0.152: IC16.1 51.12,54.29 v51.12,17.14
  Bottom 0.152: IC3.3 56.2,17.46 51.44,17.46 v51.12,17.14 39.69,5.71 30.48,5.71 JP1.4
N$31  (via drill 0.35)
  Top 0.152: IC3.1 51.75,16.83 51.75,21.91 51.44,22.23 51.44,33.02 v51.75,33.34 | v50.48,34.61 49.53,35.56 49.53,74.93 48.26,76.2 48.26,80.64 57.15,89.53 R16.1
  Bottom 0.152: v50.48,34.61 v51.75,33.34
N$32
  Top 0.152: R5.2 24.18,76.78 U3.2
N$34
  Top 1.27: D5.A 27.94,123.83 X2.2 25.4,120.02 D4.A 19.05,113.67 19.05,105.8 20.83,104.03 20.83,95.79 24.13,92.48 Q2.2
N$35
  Bottom 0.152: U4.1 26.67,103.5 R7.2
N$36
  Top 1.27: D4.C 27.94,112.39 U4.2
N$38  (via drill 0.35)
  Top 0.152: v72.39,17.46 72.39,60.33 68.58,64.14 v68.58,68.9 | v73.66,73.98 73.66,80.64 82.55,89.53 R22.1
  Bottom 0.152: v73.66,73.98 v68.58,68.9 | v72.39,17.46 73.98,15.88 IC4.1
N$39
  Top 0.152: IC1.13 10.79,31.11 8.26,33.66 8.26,55.24 6.99,56.52 6.99,70.17 7.94,71.12 7.94,75.56 7.62,75.88 7.62,78.11 19.05,89.53 R7.1
N$41
  Bottom 0.152: IC14.3 19.05,52.07 20.32,52.07 20.95,51.44 20.95,49.21 22.23,47.94 62.87,47.94 64.14,49.21 64.14,51.44 64.77,52.07 79.38,52.07 80.64,50.8 IC12.14
N$42  (via drill 0.35)
  Top 0.152: IC14.1 9.21,56.83 v9.21,52.7 | v81.6,45.09 82.23,44.45 82.23,39.69 80.64,38.1 IC11.14
  Bottom 0.152: v9.21,52.7 10.79,51.12 10.79,48.26 12.7,46.35 80.33,46.35 v81.6,45.09
N$43
  Top 0.152: R15.1 59.69,84.45 63.5,84.45 64.52,85.47 Q5.3
N$44  (via drill 0.35)
  Top 0.152: v55.88,53.02 56.2,52.7 56.2,40.96 56.2,39.05 IC9.14 | v79.06,53.02 81.28,55.24 81.28,60.96 85.09,64.77 IC13.11
  Bottom 0.152: v79.06,53.02 v55.88,53.02
N$45  (via drill 0.35)
  Top 0.152: IC10.14 58.42,50.8 58.42,61.91 v59.69,63.18
  Bottom 0.152: v59.69,63.18 78.42,63.18 80.01,64.77 IC13.13
N$46
  Top 0.152: R9.1 34.29,84.45 38.1,84.45 39.12,85.47 Q3.3
N$47
  Top 0.152: U5.3 41.91,79.25 R9.2
N$48
  Top 0.152: R8.2 36.88,76.78 U5.2
N$49
  Top 1.27: D7.A 40.64,123.83 X3.2 38.1,120.02 D6.A 31.75,113.67 31.75,105.8 33.53,104.03 33.53,95.79 36.83,92.48 Q3.2
N$50
  Bottom 0.152: U6.1 39.37,103.5 R10.2
N$51
  Top 1.27: D6.C 40.64,112.39 U6.2
N$52  (via drill 0.35)
  Top 0.152: IC7.3 33.97,30.8 33.97,55.56 34.92,56.52 34.92,67.94 | 34.92,67.94 34.92,75.88 34.29,76.52 U5.1 | 34.92,67.94 v35.24,67.94
  Bottom 0.152: IC13.6 90.17,62.87 89.53,63.5 88.9,64.14 88.9,66.67 87.63,67.94 v35.24,67.94
N$53
  Top 0.152: R12.1 46.99,84.45 50.8,84.45 51.82,85.47 Q4.3
N$54
  Top 0.152: R12.2 54.61,79.06 52.39,76.83 U7.3
N$55
  Top 0.152: R11.2 49.58,76.78 U7.2
N$56
  Top 1.27: D9.A 53.34,123.83 X4.2 50.8,120.02 D8.A 44.45,113.67 44.45,105.8 46.23,104.03 46.23,95.79 49.53,92.48 Q4.2
N$57
  Bottom 0.152: U8.1 52.07,103.5 R13.2
N$58
  Top 1.27: D8.C 53.34,112.39 U8.2
N$59
  Top 0.152: IC8.3 35.56,43.18 35.56,48.26 36.2,48.9 36.2,55.24 37.47,56.52 37.47,66.36 41.27,70.17 45.4,70.17 46.99,71.75 U7.1
  Bottom 0.152: IC13.8 86.36,71.75 86.36,77.47 85.72,78.11 48.9,78.11 47.62,76.83 U7.1
N$60
  Top 0.152: U9.3 67.31,79.25 R15.2
N$61  (via drill 0.35)
  Top 0.152: v30.48,17.14 27.94,19.68 27.94,70.8 22.86,75.88 22.86,80.64 31.75,89.53 R10.1
  Bottom 0.152: IC2.1 31.11,17.14 v30.48,17.14
N$62
  Top 0.152: R14.2 62.28,76.78 U9.2
N$63
  Top 1.27: D11.A 66.04,123.83 X5.2 63.5,120.02 D10.A 57.15,113.67 57.15,105.8 58.93,104.03 58.93,95.79 62.23,92.48 Q5.2
N$64
  Bottom 0.152: U10.1 64.77,103.5 R16.2
N$65
  Top 1.27: D10.C 66.04,112.39 U10.2
N$67
  Top 0.152: R18.1 72.39,84.45 76.2,84.45 77.22,85.47 Q6.3
N$68
  Top 0.152: U11.3 80.01,79.25 R18.2
N$69
  Top 0.152: R17.2 74.98,76.78 U11.2
N$70
  Top 1.27: D13.A 78.74,123.83 X6.2 76.2,120.02 D12.A 69.85,113.67 69.85,105.8 71.63,104.03 71.63,95.79 74.93,92.48 Q6.2
N$71
  Bottom 0.152: U12.1 77.47,103.5 R19.2
N$72
  Top 1.27: D12.C 78.74,112.39 U12.2
N$73
  Top 0.152: 71.75,72.07 71.75,75.88 72.39,76.52 U11.1 | IC10.3 59.05,43.81 59.05,54.61 60.96,56.52 60.96,66.36 64.77,70.17 69.85,70.17 71.75,72.07 | 71.75,72.07 73.34,70.48 77.47,70.48 IC13.12
N$74
  Top 0.152: IC15.10 49.21,57.47 49.21,39.05 IC7.9
N$75
  Top 0.152: R19.1 69.85,89.53 58.42,78.11 58.42,75.88 58.74,75.56 58.74,71.12 55.88,68.26 55.88,64.14 55.56,63.82 55.56,56.2 53.98,54.61 53.98,24.77 IC3.13
N$76
  Top 0.152: R21.1 85.09,84.45 88.9,84.45 89.92,85.47 Q7.3
N$77
  Top 0.152: U13.3 92.71,79.25 R21.2
N$78
  Top 0.152: R20.2 87.68,76.78 U13.2
N$79
  Top 1.27: D15.A 91.44,123.83 X7.2 88.9,120.02 D14.A 82.55,113.67 82.55,105.8 84.33,104.03 84.33,95.79 87.63,92.48 Q7.2
N$80
  Bottom 0.152: U14.1 90.17,103.5 R22.2
N$81
  Top 1.27: D14.C 91.44,112.39 U14.2
N$82
  Top 0.152: U13.1 85.09,76.2 86.04,75.25 86.04,63.82 83.82,61.59 83.82,56.52 82.23,54.93 82.23,46.99 80.96,45.72 80.96,44.77 81.92,43.81 81.92,41.27 79.38,38.73 79.38,31.11 IC11.3
  Bottom 0.152: IC14.2 8.57,60.01 8.57,62.23 9.84,63.5 26.67,63.5 38.73,75.56 83.19,75.56 84.45,76.83 U13.1
N$83
  Top 0.152: R24.1 97.79,84.45 101.6,84.45 102.62,85.47 Q8.3
N$84
  Top 0.152: U15.3 105.41,79.25 R24.2
N$85
  Top 0.152: R23.2 100.38,76.78 U15.2
N$86
  Top 1.27: D17.A 104.14,123.83 X8.2 101.6,120.02 D16.A 95.25,113.67 95.25,106.05 97.03,104.27 97.03,95.79 100.33,92.48 Q8.2
N$87
  Bottom 0.152: U16.1 102.87,103.5 R25.2
N$88
  Top 1.27: D16.C 104.14,112.39 U16.2
N$89  (via drill 0.35)
  Top 0.152: v15.88,53.66 IC14.4 | v76.52,47.31 80.64,43.18 IC12.3
  Bottom 0.152: v15.88,53.66 18.41,51.12 18.41,48.58 19.68,47.31 v76.52,47.31 95.25,47.31 97.79,49.85 U15.1
N$90
  Top 0.152: R25.1 95.25,89.53 86.36,80.64 86.36,56.52 87,55.88 87,36.2 81.92,31.11 81.92,26.04 IC4.13
N$91
  Top 0.152: IC15.11 38.73,64.77 42.55,60.96 42.55,55.24 IC8.9
N$92
  Top 0.152: IC10.9 69.53,51.12 69.53,55.56 68.26,56.83 68.26,59.05 67.63,59.69 63.5,59.69 62.87,59.05 62.23,58.42 IC16.4
N$93  (via drill 0.35)
  Top 0.152: IC9.3 58.74,30.8 58.74,39.05 56.52,41.27 56.52,55.88 55.88,56.52 55.88,61.59 58.1,63.82 | 58.1,63.82 58.42,64.14 58.42,70.17 59.69,71.44 U9.1 | 58.1,63.82 v58.74,63.18
  Bottom 0.152: IC13.10 84.77,62.55 59.37,62.55 v58.74,63.18
RESET  (via drill 0.35)
  Top 0.152: IC4.4 84.45,21.27 86.68,23.5 IC4.10 | IC2.4 40.96,16.83 40.96,21.27 42.55,22.86 IC2.10 | v60.33,20.32 IC3.4 | IC14.12 14.61,64.14 14.61,52.7 15.88,51.44 15.88,26.67 18.41,24.13 IC1.10 18.41,22.86 17.14,21.59 17.14,17.14 IC1.4
  Bottom 0.152: IC2.10 45.72,20.32 v60.33,20.32 62.87,22.86 IC3.10 62.87,24.13 64.45,25.72 84.77,25.72 IC4.10 | IC2.4 38.1,17.78 23.5,17.78 18.41,22.86 IC1.10
STATE  (via drill 0.35)
  Top 0.152: IC1.5 20.32,17.78 20.32,22.23 20.95,22.86 IC1.9 20.95,24.13 18.41,26.67 IC14.5 | IC4.5 87,20.95 IC4.9 | IC2.5 44.45,17.78 44.45,22.23 45.09,22.86 IC2.9 | v62.87,20.32 IC3.5
  Bottom 0.152: 63.82,21.27 65.41,22.86 IC3.9 | 63.82,21.27 v62.87,20.32 | 42.86,16.19 44.45,17.78 60.96,17.78 IC3.5 70.17,8.57 X16.1 | IC4.9 87.31,21.27 63.82,21.27 | IC1.9 26.35,18.1 40.96,18.1 42.86,16.19 | 42.86,16.19 IC2.5
V0  (via drill 0.35)
  Top 0.152: IC5.4 15.56,30.8 15.56,40.96 14.61,41.91 IC6.4 | IC7.4 36.51,30.8 36.51,40.96 37.47,41.91 IC8.4 | 59.05,29.84 IC9.4 | 59.05,29.84 59.05,40.64 60.33,41.91 IC10.4 | IC12.4 82.55,41.91 82.55,39.37 81.92,38.73 v81.92,33.02 | v53.34,13.97 53.98,14.61 53.98,17.14 59.05,22.23 59.05,29.84
  Bottom 0.152: IC5.4 16.83,32.07 35.88,32.07 | 35.88,32.07 36.51,31.43 37.47,30.48 IC7.4 | 80.96,32.07 IC11.4 | 61.91,32.07 80.96,32.07 | 61.91,32.07 60.33,30.48 IC9.4 | 80.96,32.07 v81.92,33.02 | JP2.1 50.16,13.97 v53.34,13.97 | 61.91,32.07 37.15,32.07 35.88,32.07
V1
  Top 0.152: IC9.5 61.91,30.8 61.91,35.88 61.59,36.2 61.59,40.64 62.87,41.91 IC10.5 | IC5.5 18.1,30.8 18.1,40.96 17.14,41.91 IC6.5 | IC8.5 40.01,41.91 38.73,40.64 38.73,36.2 39.05,35.88 39.05,30.8 IC7.5 40.01,29.21 43.81,25.4 43.81,22.23 41.27,19.68 41.27,13.97 JP2.2
  Bottom 0.152: IC11.5 85.72,27.94 | 64.45,27.62 63.82,28.26 62.87,29.21 IC9.5 | IC12.5 88.58,39.69 90.81,39.69 92.08,38.42 92.08,28.57 91.44,27.94 85.72,27.94 | IC5.5 19.37,27.62 38.42,27.62 | 38.42,27.62 40.01,29.21 IC7.5 | 38.42,27.62 63.18,27.62 64.45,27.62 | 85.72,27.94 85.41,27.62 64.45,27.62
V2
  Top 0.152: IC12.6 87.31,41.59 87.31,31.43 88.27,30.48 IC11.6 | IC5.6 20.64,30.8 20.64,40.96 19.68,41.91 IC6.6 | IC8.6 42.55,41.91 43.5,40.96 43.5,30.8 IC7.6 42.23,29.53 42.23,28.89 46.04,25.08 46.04,22.54 48.58,20 48.58,9.21 JP2.3
  Bottom 0.152: IC11.6 88.27,30.48 87,31.75 85.09,31.75 84.45,31.11 84.45,28.89 83.5,27.94 67.31,27.94 IC9.6 63.5,31.75 62.55,31.75 61.59,30.8 61.59,28.57 60.96,27.94 43.81,27.94 42.55,29.21 IC7.6 42.55,30.48 41.27,31.75 39.37,31.75 38.73,31.11 38.73,28.89 37.78,27.94 21.59,27.94 IC5.6 | IC10.6 63.5,44.45 60.01,44.45 59.05,43.5 59.05,41.59 57.78,40.32 44.13,40.32 42.55,41.91 IC8.6
V3  (via drill 0.35)
  Top 0.152: IC10.7 67.94,41.91 66.67,40.64 66.67,36.2 66.99,35.88 66.99,30.8 IC9.7 69.53,28.26 69.53,11.11 64.77,6.35 53.98,6.35 JP2.4 49.21,11.11 49.21,25.08 45.09,29.21 IC7.7 43.81,31.11 43.81,40.64 45.09,41.91 IC8.7 45.09,43.18 v42.86,45.4 | IC12.7 90.81,41.91 89.53,40.64 89.53,31.11 IC11.7 | IC6.7 22.23,41.91 20.95,40.64 20.95,31.11 IC5.7
  Bottom 0.152: IC10.7 69.85,40.64 83.5,40.64 84.45,41.59 84.45,43.5 85.09,44.13 88.9,44.13 90.49,42.55 IC12.7 | IC6.7 25.08,45.4 v42.86,45.4
V4  (via drill 0.35)
  Top 0.152: IC9.10 68.9,38.42 v68.9,45.4 68.9,48.58 67.94,49.53 IC10.10 | IC11.10 91.76,38.42 91.76,48.58 90.81,49.53 IC12.10 | IC5.10 23.18,38.42 23.18,48.58 22.23,49.53 IC6.10 | 46.04,45.4 46.04,48.58 45.09,49.53 IC8.10 | 46.04,45.4 46.04,38.42 IC7.10 45.09,36.83 50.16,31.75 50.16,12.7 JP2.5 | 46.04,45.4 v46.35,45.4
  Bottom 0.152: IC9.10 70.17,39.69 76.52,39.69 77.15,39.05 78.42,39.05 78.74,39.37 89.53,39.37 90.81,38.1 IC11.10 | IC6.10 24.13,48.26 43.81,48.26 45.09,49.53 IC8.10 | v46.35,45.4 v68.9,45.4
V5
  Top 0.152: IC5.11 18.73,38.42 18.73,48.58 19.68,49.53 IC6.11 | IC8.11 42.55,49.53 41.27,48.26 41.27,38.73 IC7.11 | IC11.11 89.22,38.42 89.22,40.96 89.53,41.27 89.53,48.26 88.27,49.53 IC12.11 | IC10.11 65.41,49.53 64.45,48.58 64.45,38.42 IC9.11 65.41,36.83 64.45,35.88 64.45,7.51 63.63,6.68 63.51,6.68 63.5,6.67 58.74,6.67 JP2.6
  Bottom 0.152: IC5.11 21.59,35.56 37.78,35.56 38.73,36.51 38.73,38.42 39.69,39.37 41.27,39.37 42.55,38.1 IC7.11 44.45,35.56 60.64,35.56 61.59,36.51 61.59,38.42 62.55,39.37 64.14,39.37 65.41,38.1 IC9.11 | IC12.11 86.04,47.94 66.99,47.94 65.41,49.53 IC10.11
V6
  Top 0.152: IC5.12 16.19,38.42 16.19,48.58 17.14,49.53 IC6.12 | IC7.12 40.96,38.42 40.96,48.58 40.01,49.53 IC8.12 | IC12.12 85.72,49.53 84.45,48.26 84.45,38.73 IC11.12 | 64.14,36.2 64.14,48.26 62.87,49.53 IC10.12 | JP2.7 60.96,6.99 63.5,6.99 64.14,7.62 64.14,36.2 | IC9.12 64.14,36.2
  Bottom 0.152: IC5.12 19.37,35.24 41.59,35.24 | IC11.12 83.5,35.24 65.09,35.24 | IC9.12 65.09,35.24 | 41.59,35.24 40.01,36.83 IC7.12 | 65.09,35.24 41.59,35.24
V7
  Top 0.152: IC5.13 13.65,38.42 13.65,48.58 14.61,49.53 IC6.13 | IC11.13 84.14,38.42 84.14,48.58 83.19,49.53 IC12.13 | IC10.13 60.33,49.53 61.59,48.26 61.59,41.27 61.28,40.96 61.28,38.42 IC9.13 60.33,36.83 61.59,35.56 61.59,8.89 JP2.8
  Bottom 0.152: 35.24,39.69 36.2,38.73 IC7.13 | 35.24,39.69 16.19,39.69 14.61,38.1 IC5.13 | IC8.13 39.69,52.39 58.74,52.39 | 58.74,52.39 60.33,50.8 IC10.13 | IC12.13 80.96,52.39 58.74,52.39 | IC9.13 60.33,38.1 58.74,39.69 37.15,39.69 35.24,39.69

### Text on the board
tDocu: 1 | 2 | 3 | 4 | 5 | 6 | 7 | 8 | - | + | - | + | - | + | - | - | + | - | + | - | + | - | + | + | Solenoid Power / Inputs | GND | 12V | GND | 12V | GND | 12V | GND | -12V | GND | -12V | GND | github.com/kpzip | 5V | Aux Power Inputs | 8x Solenoid Driver Board with Single-Shot PWM Volume control | Designed By Kyle Schmerge | 1 | 2 | 3 | 4 | 5 | 6 | 7 | 8 | LSD | MSD | GND | CLK | GND | STATE | Inputs | Clock In/Out